# EasyEDA Pro project zx_tcp_serial.eprj

# Schematic Schematic1
Create Date: 2023-01-03; Page Name: P1; Project Name: zx_tcp_serial; Schematic Name: Schematic1; Update Date: 2023-02-12; Company: 嘉立创EDA; Page Size: A4; Version: V1.0
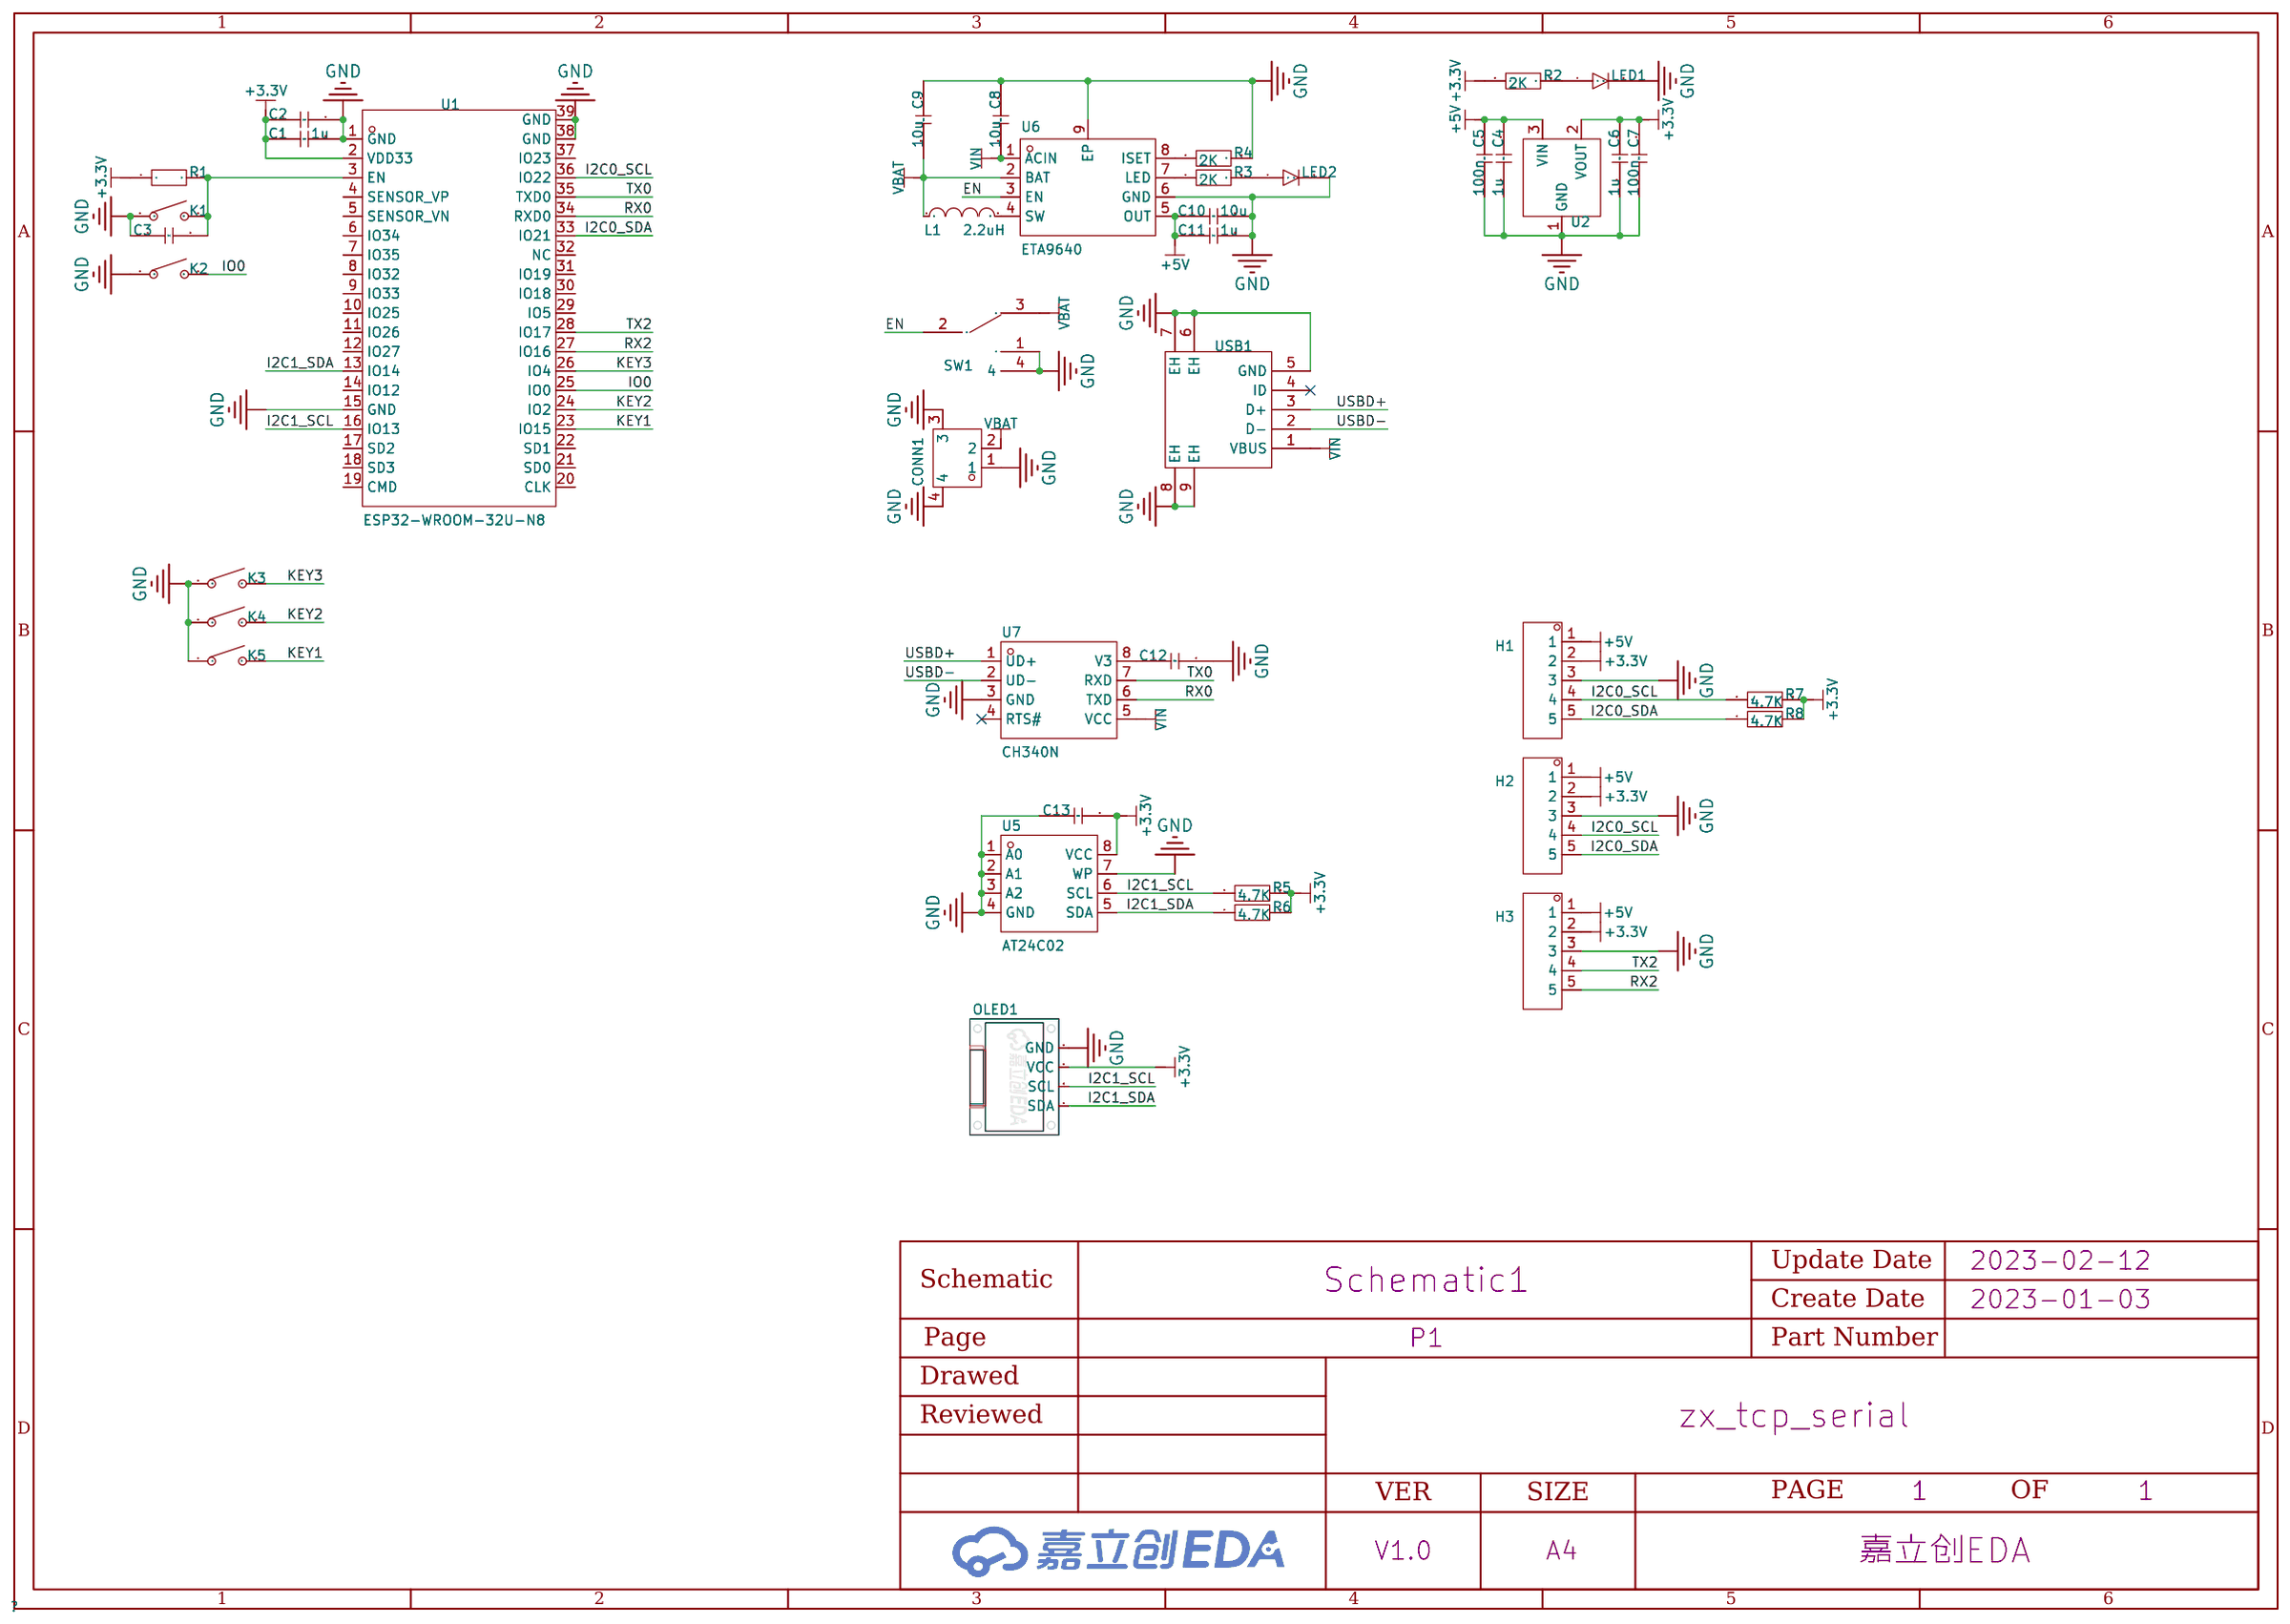
[diagram p0: schematic sheet]

## Parts
C1  1u  [C0603]
C2  100n  [C0603]
C3  100n  [C0603]
C4  1u  [C0603]
C5  100n  [C0603]
C6  1u  [C0603]
C7  100n  [C0603]
C8  10u  [C0603]
C9  10u  [C0603]
C10  10u  [C0603]
C11  1u  [C0603]
C12  100n  [C0603]
C13  100n  [C0603]
CONN1  WAFER-SH1.0-2PWB  [CONN-SMD_2P-P1.00_XUNPU_WAFER-SH1.0-2PWB]
H1  -  [HDR-TH_5P-P2.54-V-M]
H2  -  [HDR-TH_5P-P2.54-V-M]
H3  -  [HDR-TH_5P-P2.54-V-M]
K1  -  [SW-SMD_L6.0-W3.6-LS8.0]
K2  -  [SW-SMD_L6.0-W3.6-LS8.0]
K3  -  [SW-SMD_L6.0-W3.6-LS8.0]
K4  -  [SW-SMD_L6.0-W3.6-LS8.0]
K5  -  [SW-SMD_L6.0-W3.6-LS8.0]
L1  2.2uH  [IND-SMD_L4.4-W4.2]
LED1  green  [LED0603]
LED2  red  [LED0603]
OLED1  -  [OLED_0.96_4P]
R1  10K  [R0603]
R2  2K  [R0603]
R3  2K  [R0603]
R4  2K  [R0603]
R5  4.7K  [R0603]
R6  4.7K  [R0603]
R7  4.7K  [R0603]
R8  4.7K  [R0603]
SW1  拨动开关/MSK01-AG1.5/7.8*1.5*4.2mm  [SW-TH_MSK01-AG1.5]
U1  ESP32-WROOM-32U-N8  [WIFIM-SMD_39P-L19.2-W18.0-P1.27]
U2  AMS1117-3.3  [SOT-89-3]
U5  AT24C02  [SOIC-8_L4.9-W3.9-P1.27-LS6.0-BL]
U6  ETA9640  [ESOP-8_L4.9-W3.9-P1.27-LS6.0-BL-EP]
U7  CH340N  [SOP-8_L5.0-W4.0-P1.27-LS6.0-BL]
USB1  KH-MICRO-SMT.J7.2-5P  [MICRO-USB-SMD_KH-MICRO-SMT.J7.2-5P]

## Library data of the parts
C1-C13 = C0603
CONN1 = WAFER-SH1.0-2PWB: 间距:1mm;插针结构:1x2P;排数:1;每排PIN数:2;公母:公型插针;安装方式:卧贴;额定电流:1A;工作温度范围:-25℃~+85℃;; LCSC Part Name: SH1.00mm 2P 卧贴; Supplier Part: C3029341; Manufacturer: XUNPU(讯普); Supplier Footprint: SMD,P=1mm; JLCPCB Part Class: 扩展库; Datasheet: https://atta.szlcsc.com/upload/public/pdf/source/20220527/1879B8210BD3B2006BCEAC1A40D397B6.pdf; Supplier: LCSC; Pitch: 1mm; Pins Structure: 1x2P; Number of Rows: 1; Number of PINs Per Row: 2; Gender: 公型插针; Mounting Style: 卧贴; Current Rating (Max): 1A; Operating Temperature Range: -25℃~+85℃
H1-H3 = HDR-M_2.54_1x5P: Supplier Part: C358687; Supplier Footprint: 插件
K1-K5 = TOUCH_SWITCH
L1 = 4.7uH/2.5A: Supplier Part: C9900022127; JLCPCB Part Class: 扩展库; Supplier: LCSC
LED1 = LED-G
LED2 = LED-R
OLED1 = OLED_0.96_4P
R1-R8 = R0603
SW1 = 拨动开关/MSK01-AG1.5/7.8*1.5*4.2mm: Supplier Part: C9900018898; Supplier Footprint: SMD:7.8*1.5*4.2mm; JLCPCB Part Class: 扩展库; Datasheet: https://atta.szlcsc.comnull; Supplier: LCSC
U1 = ESP32-WROOM-32U-N8: Supplier Part: C529579; Manufacturer: ESPRESSIF(乐鑫); Supplier Footprint: Module; JLCPCB Part Class: 扩展库; Datasheet: https://atta.szlcsc.com/upload/public/pdf/source/20200521/C529577_90A62DBC94C4A28650A646C18DE51576.pdf; Supplier: LCSC
U2 = AMS1117
U5 = AT24C02: Supplier Part: C9900001040; Supplier Footprint: SOIC-8; JLCPCB Part Class: 扩展库; Datasheet: 2021-10-25/445635K/0a4594f4b02c4a15b36b3c7f9f2a12b8/AT24C02.pdf; Supplier: LCSC
U6 = ETA9640: Supplier Part: C2762434; Supplier Footprint: MSOP-8EP(3.9x4.9x1.27); JLCPCB Part Class: 扩展库; Datasheet: 2021-03-16/241412B/ce3fe8f43ee1499fa96186e93547024a/ETA9640 _V1.1.pdf; Supplier: LCSC
U7 = CH340N: Supplier Part: C506813; Manufacturer: WCH(南京沁恒); Supplier Footprint: SOP-8; JLCPCB Part Class: 扩展库; Datasheet: https://atta.szlcsc.com/upload/public/pdf/source/20200819/C84681_ADBED554CE321879DBD6B1D06488689C.pdf; Supplier: LCSC
USB1 = KH-MICRO-SMT.J7.2-5P: 连接器类型:Micro-B;标准:USB 2.0;公母:母座;触点数量:5;端口数量:1;安装方式:卧贴;额定电流 - 电源:1A;工作温度范围:-30℃~+80℃;; LCSC Part Name: Micro-B 母座 卧贴; Supplier Part: C2688801; Manufacturer: kinghelm(金航标); Supplier Footprint: SMD; JLCPCB Part Class: 扩展库; Datasheet: https://atta.szlcsc.com/upload/public/pdf/source/20210202/C2688801_229287E4F6FB01E5C7708C9D4F7A0145.pdf; Supplier: LCSC; Connector Type: Micro-B; Standard: USB 2.0; Gender: 母座; Number of Contacts: 5; Number of Ports: 1; Mounting Style: 卧贴; Current Rating - Power (Max): 1A; Operating Temperature Range: -30℃~+80℃

## Nets
+3.3V: C1.1 C2.1 C6.2 C7.2 C13.2 H1.2 H2.2 H3.2 OLED1.2(VCC) R1.1 R2.1 R5.2 R6.2 R7.2 R8.2 U1.2(VDD33) U2.2(VOUT) U5.8(VCC)
+5V: C4.2 C5.2 C10.1 C11.1 H1.1 H2.1 H3.1 U2.3(VIN) U6.5(OUT)
GND: C1.2 C2.2 C3.1 C4.1 C5.1 C6.1 C7.1 C8.2 C9.2 C10.2 C11.2 C12.2 C13.1 CONN1.1 CONN1.3 CONN1.4 H1.3 H2.3 H3.3 K1.1 K2.1 K3.1 K4.1 K5.1 LED1.2 LED2.2 OLED1.1(GND) R4.2 SW1.1 SW1.4 U1.1(GND) U1.15(GND) U1.38(GND) U1.39(GND) U2.1(GND) U5.1(A0) U5.2(A1) U5.3(A2) U5.4(GND) U5.7(WP) U6.6(GND) U6.9(EP) U7.3(GND) USB1.5(GND) USB1.6(EH) USB1.7(EH) USB1.8(EH) USB1.9(EH)
VBAT: C9.1 CONN1.2 L1.1 SW1.3 U6.2(BAT)
VIN: C8.1 U6.1(ACIN) U7.5(VCC) USB1.1(VBUS)
EN: SW1.2 U6.3(EN)
I2C0_SCL: H1.4 H2.4 R7.1 U1.36(IO22)
I2C0_SDA: H1.5 H2.5 R8.1 U1.33(IO21)
I2C1_SCL: OLED1.3(SCL) R5.1 U1.16(IO13) U5.6(SCL)
I2C1_SDA: OLED1.4(SDA) R6.1 U1.13(IO14) U5.5(SDA)
IO0: K2.2 U1.25(IO0)
KEY1: K5.2 U1.23(IO15)
KEY2: K4.2 U1.24(IO2)
KEY3: K3.2 U1.26(IO4)
RX0: U1.34(RXD0) U7.6(TXD)
RX2: H3.5 U1.27(IO16)
TX0: U1.35(TXD0) U7.7(RXD)
TX2: H3.4 U1.28(IO17)
USBD+: U7.1(UD+) USB1.3(D+)
USBD-: U7.2(UD-) USB1.2(D-)
$1N4671: C3.2 K1.2 R1.2 U1.3(EN)
$1N5092: LED1.1 R2.2
$1N6706: LED2.1 R3.2
$1N24730: L1.2 U6.4(SW)
$1N24732: R3.1 U6.7(LED)
$1N24734: R4.1 U6.8(ISET)
$1N25103: C12.1 U7.8(V3)

Not connected (* = marked no-connect by the designer): U1 4(SENSOR_VP) 5(SENSOR_VN) 6(IO34) 7(IO35) 8(IO32) 9(IO33) 10(IO25) 11(IO26) 12(IO27) 14(IO12) 17(SD2) 18(SD3) 19(CMD) 20(CLK) 21(SD0) 22(SD1) 29(IO5) 30(IO18) 31(IO19) 32(NC) 37(IO23); U7 4(RTS#)*; USB1 4(ID)*

# Board PCB1
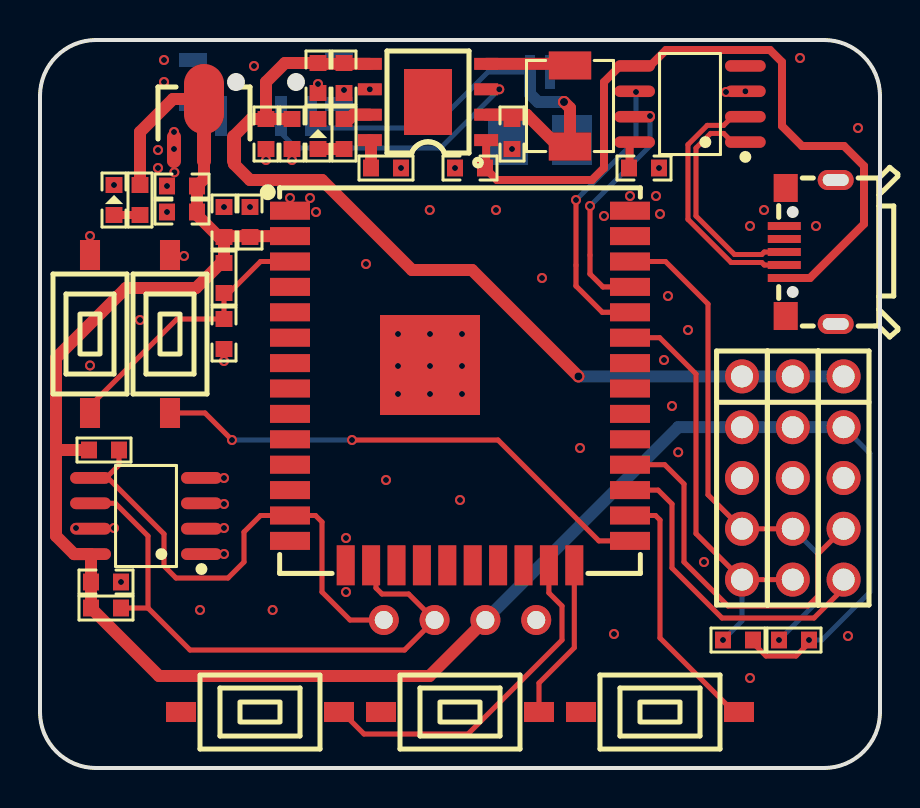
[diagram p1: board, top side]
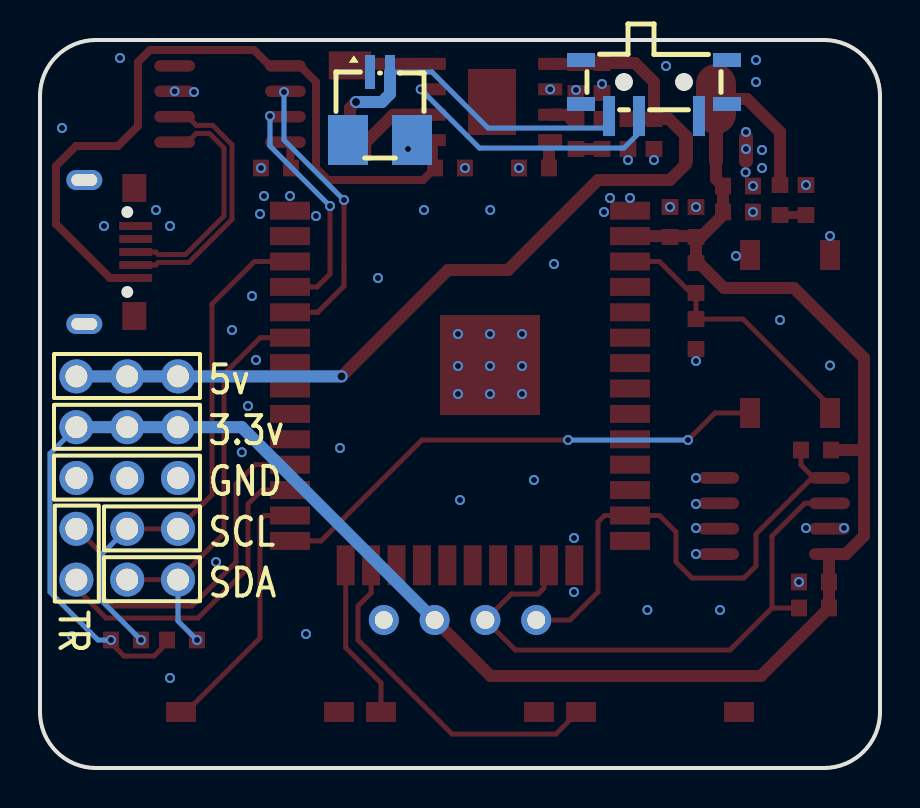
[diagram p2: board, bottom side, seen from below]

Outline 42 x 36.4 mm; copper layers: Top Layer, Bottom Layer. Coordinates in mm from the lower left corner of the outline.
Outline path: 0,33.6 arc(0.82,35.58) 2.8,36.4 39.2,36.4 arc(41.18,35.58) 42,33.6 42,2.8 arc(41.18,0.82) 39.2,0 2.8,0 arc(0.82,0.82) 0,2.8 0,33.6
Stack: Top Layer 0.035mm / Dielectric1 1.51mm FR4 er 4.5 / Bottom Layer 0.035mm

## Design rules (mm)
net USBD-: DP1
net USBD+: DP1
spacing safeClearance (default): track to track 0.152, other pairs 0.152 to 0.3
track width trackWidth (default): min 0.127, default 0.254, max 2.54
differential pair differentialPair (default): width min 0.127, default 0.254, max 2.54; gap min 0.152, default 0.152
via viaSize (default): diameter min 0.5, default 0.61, max 10; hole min 0.3, default 0.305, max 6

## Placement (name value [footprint] x y rotation side)
C1  1u  [C0603]  9.2 27.3 90 top
C2  100n  [C0603]  10.5 27.3 90 top
C3  100n  [C0603]  9.2 21.7 90 top
C4  1u  [C0603]  11.3 31.7 90 top
C5  100n  [C0603]  12.6 31.7 90 top
C6  1u  [C0603]  7.1 27.8 0 top
C7  100n  [C0603]  7.1 29.1 0 top
C8  10u  [C0603]  21.5 30 180 top
C9  10u  [C0603]  23.6 31.7 270 top
C10  10u  [C0603]  15.2 34.5 270 top
C11  1u  [C0603]  13.9 34.5 270 top
C12  100n  [C0603]  30.2 30 0 top
C13  100n  [C0603]  3.3 9.3 180 top
CONN1  WAFER-SH1.0-2PWB  [CONN-SMD_2P-P1.00_XUNPU_WAFER-SH1.0-2PWB]  25 33.1 180 bottom
H1  -  [HDR-TH_5P-P2.54-V-M]  37.64 14.5 270 top
H2  -  [HDR-TH_5P-P2.54-V-M]  35.1 14.5 270 top
H3  -  [HDR-TH_5P-P2.54-V-M]  40.18 14.5 270 top
K1  -  [SW-SMD_L6.0-W3.6-LS8.0]  2.5 21.7 270 top
K2  -  [SW-SMD_L6.0-W3.6-LS8.0]  6.5 21.7 270 top
K3  -  [SW-SMD_L6.0-W3.6-LS8.0]  31 2.8 0 top
K4  -  [SW-SMD_L6.0-W3.6-LS8.0]  21 2.8 0 top
K5  -  [SW-SMD_L6.0-W3.6-LS8.0]  11 2.8 0 top
L1  2.2uH  [IND-SMD_L4.4-W4.2]  26.5 33.1 270 top
LED1  green  [LED0603]  3.7 28.4 90 top
LED2  red  [LED0603]  13.9 31.7 90 top
OLED1  -  [OLED_0.96_4P]  21 19 180 top
R1  10K  [R0603]  9.2 24.5 270 top
R2  2K  [R0603]  5 28.4 270 top
R3  2K  [R0603]  15.2 31.7 270 top
R4  2K  [R0603]  17.3 30 0 top
R5  4.7K  [R0603]  3.3 8 180 top
R6  4.7K  [R0603]  3.2 15.9 180 top
R7  4.7K  [R0603]  37.7 6.4 0 top
R8  4.7K  [R0603]  34.9 6.4 0 top
SW1  拨动开关/MSK01-AG1.5/7.8*1.5*4.2mm  [SW-TH_MSK01-AG1.5]  11.3 34 0 bottom
U1  ESP32-WROOM-32U-N8  [WIFIM-SMD_39P-L19.2-W18.0-P1.27]  21 19 0 top
U2  AMS1117-3.3  [SOT-89-3]  8.2 32.2 0 top
U5  AT24C02  [SOIC-8_L4.9-W3.9-P1.27-LS6.0-BL]  5.3 12.6 90 top
U6  ETA9640  [ESOP-8_L4.9-W3.9-P1.27-LS6.0-BL-EP]  19.4 33.3 90 top
U7  CH340N  [SOP-8_L5.0-W4.0-P1.27-LS6.0-BL]  32.5 33.2 90 top
USB1  KH-MICRO-SMT.J7.2-5P  [MICRO-USB-SMD_KH-MICRO-SMT.J7.2-5P]  38.5 25.8 90 top

## Footprints (pads in the part's own frame, mm; a bottom-side part is the same pattern mirrored in y, then rotated)
C0603
  rect 0.8x0.84 smd: 1(-0.75,0) 2(0.75,0)
CONN-SMD_2P-P1.00_XUNPU_WAFER-SH1.0-2PWB
  rect 0.5x1.7 smd: 1(-0.5,1.7) 2(0.5,1.7)
  rect 2x2.5 smd: 3(1.6,-1.7) 4(-1.6,-1.7)
ESOP-8_L4.9-W3.9-P1.27-LS6.0-BL-EP
  rect 0.6x1.2 smd: 1(-1.905,-2.909) 2(-0.635,-2.909) 3(0.635,-2.909) 4(1.905,-2.909) 5(1.905,2.909) 6(0.635,2.909) 7(-0.635,2.909) 8(-1.905,2.909)
  rect 3.3x2.4 smd: 9(0,0)
HDR-TH_5P-P2.54-V-M
  round 1.7 hole 1.1: 1(-5.08,0) 2(-2.54,0) 3(0,0) 4(2.54,0) 5(5.08,0)
IND-SMD_L4.4-W4.2
  rect 1.4x2.12 smd: 1(2.028,0) 2(-2.028,0)
LED0603
  rect 0.8x0.84 smd: 1(-0.75,0) 2(0.75,0)
MICRO-USB-SMD_KH-MICRO-SMT.J7.2-5P
  rect 0.399x1.651 smd: 1(-1.3,1.285) 2(-0.65,1.285) 3(0,1.285) 4(0.65,1.285) 5(1.3,1.285)
  rect 1.399x1.199 smd: 6(-3.2,1.214) 9(3.2,1.214)
  oval 1.001x1.801 hole 0.6x1.3: 7(-3.599,-1.285) 8(3.599,-1.285)
OLED_0.96_4P
  round 1.5 hole 0.9: 1(-3.81,11.6) 2(-1.27,11.6) 3(1.27,11.6) 4(3.81,11.6)
R0603
  rect 0.8x0.84 smd: 1(-0.75,0) 2(0.75,0)
SOIC-8_L4.9-W3.9-P1.27-LS6.0-BL
  oval 0.588x2.045 smd: 1(-1.905,-2.772) 2(-0.635,-2.772) 3(0.635,-2.772) 4(1.905,-2.772) 5(1.905,2.772) 6(0.635,2.772) 7(-0.635,2.772) 8(-1.905,2.772)
SOP-8_L5.0-W4.0-P1.27-LS6.0-BL
  oval 0.574x2.035 smd: 1(-1.905,-2.768) 2(-0.635,-2.768) 3(0.635,-2.768) 4(1.905,-2.768) 5(1.905,2.768) 6(0.635,2.768) 7(-0.635,2.768) 8(-1.905,2.768)
SOT-89-3
  oval 0.7x1.9 smd: 1(-1.501,-1.25) 3(1.501,-1.25)
  oval 2x3.5 smd: 2(0,1.25)
  oval 0.7x2.1 smd: 2(0,-1.151)
SW-SMD_L6.0-W3.6-LS8.0
  rect 1.501x1.001 smd: 1(-3.95,0) 2(3.95,0)
SW-TH_MSK01-AG1.5
  rect 0.6x2 smd: 1(-2.25,1.4) 2(0.75,1.4) 3(2.25,1.4)
  rect 1.4x0.7 smd: 4(-3.65,-1.4) 4(-3.65,0.8) 4(3.65,-1.4) 4(3.65,0.8)
WIFIM-SMD_39P-L19.2-W18.0-P1.27
  rect 2x0.9 smd: 1(-8.5,8.865) 2(-8.5,7.595) 3(-8.5,6.325) 4(-8.5,5.055) 5(-8.5,3.785) 6(-8.5,2.515) 7(-8.5,1.245) 8(-8.5,-0.025) 9(-8.5,-1.295) 10(-8.5,-2.565) 11(-8.5,-3.835) 12(-8.5,-5.105) 13(-8.5,-6.375) 14(-8.5,-7.645) 25(8.5,-7.645) 26(8.5,-6.375) 27(8.5,-5.105) 28(8.5,-3.835) 29(8.5,-2.565) 30(8.5,-1.295) 31(8.5,-0.025) 32(8.5,1.245) 33(8.5,2.515) 34(8.5,3.785) 35(8.5,5.055) 36(8.5,6.325) 37(8.5,7.595) 38(8.5,8.865)
  rect 0.9x2 smd: 15(-5.715,-8.865) 16(-4.445,-8.865) 17(-3.175,-8.865) 18(-1.905,-8.865) 19(-0.635,-8.865) 20(0.635,-8.865) 21(1.905,-8.865) 22(3.175,-8.865) 23(4.445,-8.865) 24(5.715,-8.865)
  rect 5x5 smd: 39(-1.5,1.15)

## Nets
As in the schematic.

Pads without a net: U1 4 5 6 7 8 9 10 11 12 14 17 18 19 20 21 22 29 30 31 32 37; U7 4; USB1 4

## Via types
v1: diameter 0.5, hole 0.3, Top Layer to Bottom Layer, 87 vias
v2: diameter 0.6, hole 0.4, Top Layer to Bottom Layer, 2 vias

## Routing (per net, layer and track width the routed paths; a pad name or vN(x,y) marks a point on that pad's centre or on a via; arc(x,y) is an arc through that point)
+3.3V: length 102.9
  Top Layer w0.25: R8.2 35.65,6.25 36.3,5.6 37.8,5.6 38.45,6.25 v1(38.45,6.4)
  Top Layer w0.6: R2.1 5,31.8 6.65,33.45 U2.2 ; R6.2 0.8,15.9 ; 0.8,15.9 0.8,11.6 1.71,10.69 U5.8 2.55,10.67 C13.2 R5.2 5.95,4.6 19.47,4.6 OLED1.2 ; 0.8,15.9 0.8,20.5 4.3,24 7.8,24 9.05,25.25 R1.1 C1.1 ; C1.1 8.95,26.55 7.85,27.65 C6.2 C7.2 8.2,29.45 U2.2 ; C1.1 9.25,26.59 U1.2
  Bottom Layer w0.25: H3.2 41.5,15.72 41.5,8.8 39.1,6.4 v1(38.45,6.4)
  Bottom Layer w0.6: OLED1.2 31.91,17.04 H2.2 H1.2 H3.2
+5V: length 46.9
  Top Layer w0.6: C4.2 10.55,32.45 9.7,31.6 U2.3 9.7,30.2 10.5,29.4 14.1,29.4 18.6,24.9 21.6,24.9 v2(26.92,19.58) ; C4.2 12.5,32.45 ; C4.2 11.3,34.3 12.25,35.25 C11.1 13.94,35.2 U6.5
  Bottom Layer w0.6: H3.1 H1.1 H2.1 v2(26.92,19.58)
GND:
  vias: v1(1.8,12) v1(2.5,26.6) v1(2.5,20.13) v1(3.7,29.15) v1(3.7,12) v1(4.05,9.3) v1(5,22.4) v1(5.9,30.9) v1(5.9,30) v1(6.2,35.4) v1(6.2,34.3) v1(6.35,29.1) v1(6.35,27.8) v1(6.7,31.8) v1(6.7,30.95) v1(6.72,29.79) v1(7.2,25.6) v1(8,7.9) v1(9.2,28.05) v1(9.2,20.35) v1(9.2,14.5) v1(9.2,13.2) v1(9.2,12) v1(9.2,10.7) v1(10.5,28.05) v1(10.7,35.1) v1(11.3,30.4) v1(11.63,7.9) v1(12.5,28.5) v1(12.6,30.4) v1(13.5,28.5) v1(13.8,27.8) v1(13.9,34.2) v1(15.2,33.9) v1(15.3,11.5) v1(15.3,8.8) v1(16.3,25.2) v1(16.49,33.94) v1(17.3,14.4) v1(17.9,21.7) v1(17.9,20.1) v1(17.9,18.7) v1(18.05,30) v1(19.49,27.9) v1(19.5,21.7) v1(19.5,20.1) v1(19.5,18.7) v1(20.75,30) v1(21,13.4) v1(21.1,21.7) v1(21.1,20.1) v1(21.1,18.7) v1(22.8,27.9) v1(23.6,30.95) v1(25.1,24.5) v1(27,16) v1(28.2,27.6) v1(28.7,6.7) v1(29.5,28.6) v1(30.8,28.6) v1(30.95,30) v1(31,27.7) v1(31.2,20.4) v1(31.4,23.6) v1(31.6,18.1) v1(31.91,15.79) v1(32.4,21.9) v1(33.2,10.3) v1(34.3,33.8) v1(35.27,33.83) v1(35.5,27.1) v1(35.5,4.5) v1(36.2,27.9) v1(38,35.5) v1(38.8,27.1) v1(40.4,6.6) v1(40.9,32)
VBAT: length 22.8
  Top Layer w0.6: 26.5,31.1 25.9,31.1 24.34,32.67 U6.2 ; 26.5,31.1 26.5,33 v2(26.2,33.3) ; 26.5,31.1 L1.1
  Bottom Layer w0.25: 13.55,32.7 13.55,32.25 13.8,32 19.6,32 22.4,34.8 CONN1.2
  Bottom Layer w0.6: CONN1.2 24.5,33.7 24.9,33.3 v2(26.2,33.3)
VIN: length 38.1
  Top Layer w0.4: U6.1 22.31,30.06 C8.1 22.85,29.4 27.6,29.4 28.2,30 28.2,34.3 29,35.11 U7.5 30.5,35.11 31.3,35.9 36.5,35.9 37.1,35.3 37.1,32.1 38.1,31.1 40.2,31.1 41.2,30.1 41.2,27.2 38.5,24.5 USB1.1
EN: length 14
  Top Layer w0.25: v1(22.97,33.94) U6.3
  Bottom Layer w0.25: 12.05,32.7 12.1,32.65 12.1,31.7 12.8,31 20.03,31 v1(22.97,33.94)
I2C0_SCL: length 26.2
  Top Layer w0.25: H1.4 H2.4 33.4,13.66 33.4,23.2 31.28,25.33 U1.36
  Bottom Layer w0.25: H1.4 38.9,10.7 38.9,8.35 v1(36.95,6.4)
I2C0_SDA: length 21.2
  Top Layer w0.25: H1.5 H2.5 32.8,11.72 32.8,19.7 30.99,21.52 U1.33
  Bottom Layer w0.25: H2.5 35.1,7.35 v1(34.15,6.4)
I2C1_SCL: length 29.2
  Top Layer w0.25: R5.1 5.4,8 ; 5.4,8 7.5,5.9 18.23,5.9 OLED1.3 18.43,8.7 17.1,8.7 16.8,9 16.8,9.89 U1.16 ; 5.4,8 5.4,11.6 3.76,13.23 U5.6
I2C1_SDA: length 25.7
  Top Layer w0.25: R6.1 3.95,15.15 3.31,14.5 3.4,14.5 6.2,11.7 6.2,10.1 6.8,9.5 9.4,9.5 10.2,10.3 10.2,11.8 11.03,12.62 U1.13 13.78,12.62 14.1,12.3 14.1,8.8 15.5,7.4 OLED1.4
  Top Layer w0.4: U5.5 3.31,14.5
IO0: length 25.6
  Top Layer w0.25: K2.2 8.25,17.75 v1(9.6,16.4) ; v1(15.6,16.4) 22.9,16.4 27.94,11.36 U1.25
  Bottom Layer w0.25: v1(9.6,16.4) v1(15.6,16.4)
KEY1: length 17.6
  Top Layer w0.25: K5.2 15.1,2.8 16.2,1.7 21.4,1.7 26.1,6.4 26.1,8.1 25.44,8.75 U1.23
KEY2: length 8.1
  Top Layer w0.25: U1.24 26.72,6.02 24.95,4.25 K4.2
KEY3: length 13
  Top Layer w0.25: U1.26 30.78,12.62 31,12.4 31,6.5 34.7,2.8 K3.2
RX0: length 14.2
  Top Layer w0.25: v1(26.8,28.4) 26.8,25.14
  Top Layer w0.256: 26.8,25.14 26.8,24.1 28.12,22.78 U1.34
  Bottom Layer w0.25: v1(29.8,33.8) 29.8,31.4 v1(26.8,28.4)
RX2: length 16.3
  Top Layer w0.25: H3.5 40.18,8.98 38.7,7.5 34.1,7.5 31.6,10 31.6,13.2 30.91,13.89 U1.27
TX0: length 11.4
  Top Layer w0.25: v1(27.5,28.1) 27.5,25.65
  Top Layer w0.256: U1.35 28.15,24.06 27.5,24.7 27.5,25.65
  Bottom Layer w0.25: v1(30.5,32.6) 30.5,31.1 v1(27.5,28.1)
TX2: length 18.7
  Top Layer w0.25: H3.4 40.16,11.96 38.9,10.7 38.9,8.6 38.4,8.1 34.4,8.1 32.2,10.3 32.2,14.2 31.24,15.17 U1.28
USBD+: length 11.6
  Top Layer w0.25: U7.1 34.62,31.3 34.18,31.73 33.53,31.73 32.8,31 32.8,27.6 34.72,25.68 36.09,25.68 36.21,25.8 USB1.3
USBD-: length 12.9
  Top Layer w0.25: U7.2 34.62,32.56 34.18,32.13 33.36,32.13 32.4,31.17 32.4,27.43 34.56,25.27 36.09,25.27 36.21,25.15 USB1.2
$1N4671: length 14.1
  Top Layer w0.25: U1.3 11.03,25.33 9.45,23.75 R1.2 C3.2 6.85,22.45 2.5,18.1 K1.2
$1N5092: length 1.3
  Top Layer w0.4: R2.2 LED1.1
$1N6706: length 1.3
  Top Layer w0.6: R3.2 LED2.1
$1N24730: length 4.2
  Top Layer w0.6: U6.4 26.42,35.2 L1.2
$1N24732: length 1.4
  Top Layer w0.6: U6.7 15.66,32.67 15.45,32.45 R3.1
$1N24734: length 1.4
  Top Layer w0.6: R4.1 16.55,31.34 U6.8
$1N25103: length 1.6
  Top Layer w0.4: C12.1 29.48,30.03 29.48,31.28 29.5,31.3 U7.8

## Copper pours and planes (outline as drawn; the poured copper is in the pictures)
GND on Top Layer: 0,36.4 42,36.4 42,0 0,0
GND on Bottom Layer: 0,36.4 42,36.4 42,0 0,0

## Text on the board
Bottom Silkscreen Layer: 5v | 3.3v | GND | SCL | SDA | TR
